# Altium schematic sheet COG-C177MVHG-03.SchDoc
size A4
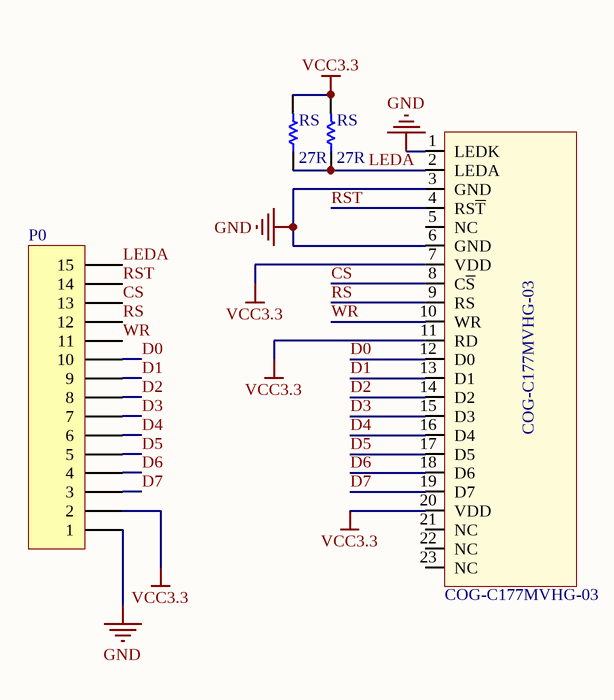
[diagram p0: COG-C177MVHG-03.SchDoc]

## Parts
(Parts that share a designator on the sheet are numbered #1, #2 ... from top to bottom, then left to right.)
LCD  COG-C177MVHG-03  [COG-C177MVHG-03]
P0  (no value)  [HDR1X15]
RS#1  value 27R  [LC-0805_R]
RS#2  value 27R  [LC-0805_R]

## Nets
GND: LCD.1(LEDK) LCD.3(GND) LCD.6(GND) P0.1
VCC3.3: LCD.7(VDD) LCD.11(RD) LCD.20(VDD) P0.2 RS#1.2 RS#2.2
CS: LCD.8(C~{S}) P0.13
D0: LCD.12(D0) P0.10
D1: LCD.13(D1) P0.9
D2: LCD.14(D2) P0.8
D3: LCD.15(D3) P0.7
D4: LCD.16(D4) P0.6
D5: LCD.17(D5) P0.5
D6: LCD.18(D6) P0.4
D7: LCD.19(D7) P0.3
LEDA: LCD.2(LEDA) P0.15 RS#1.1 RS#2.1
RS: LCD.9(RS) P0.12
RST: LCD.4(RS~{T}) P0.14
WR: LCD.10(WR) P0.11

Not connected (* = marked no-connect by the designer): LCD 5(NC) 21(NC) 22(NC) 23(NC)

## Library data of the parts
P0 = Header 15: Header, 15-Pin; LatestRevisionDate: 17-Jul-2002; LatestRevisionNote: Re-released for DXP Platform.; Publisher: Altium Limited
RS#1 RS#2 = Res1: Resistor; Published: 8-Jun-2000; LatestRevisionDate: 17-Jul-2002; LatestRevisionNote: Re-released for DXP Platform.; PackageReference: AXIAL-0.3; Publisher: Altium Limited; PackageDescription: Axial Device, Thru-Hole; 2 Leads; 0.3 in Pin Spacing